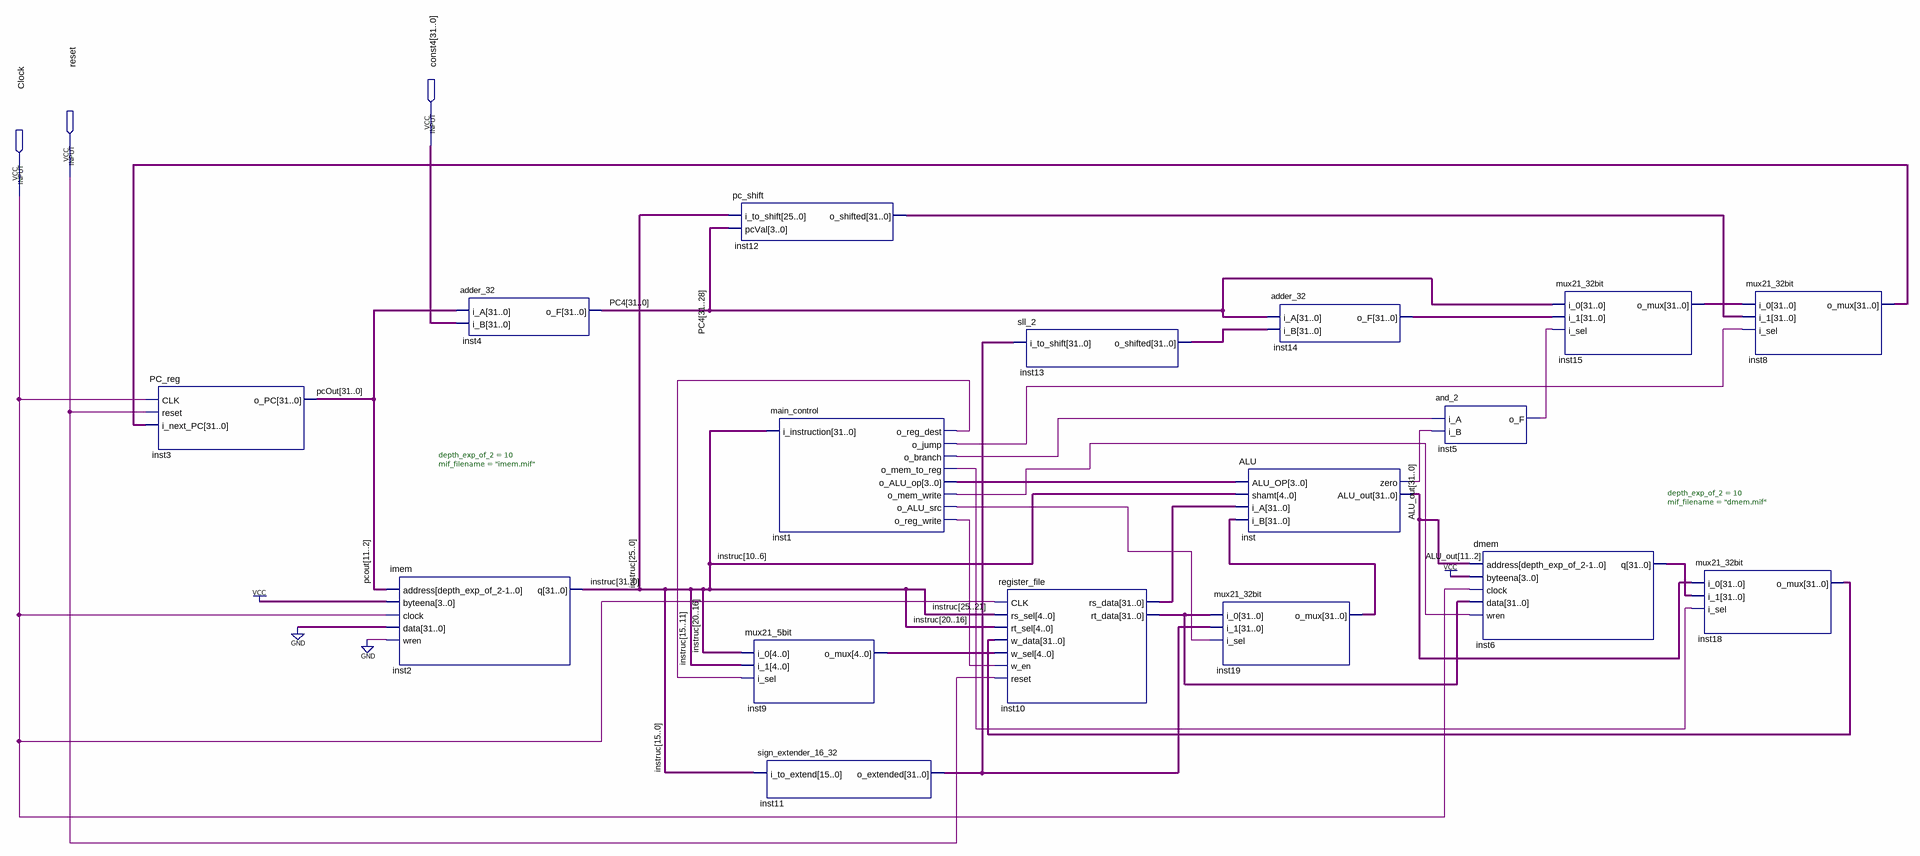
[diagram p0: schematic sheet]
// Quartus schematic Single_Cycle_MIPS_Processor.bdf as structural Verilog: 17 symbols, 3 pins
module Single_Cycle_MIPS_Processor (
  input  [31:0] const4,
  input  reset,
  input  Clock
);

  wire inst1_o_alu_src, inst1_o_branch, inst1_o_jump, inst1_o_mem_to_reg, inst1_o_mem_write,
       inst1_o_reg_dest, inst1_o_reg_write, inst5_o_f, inst_zero;
  wire [3:0] inst1_o_alu_op;
  wire [4:0] inst9_o_mux;
  wire [31:0] ALU_out, inst6_q, inst8_o_mux, inst10_rs_data, inst10_rt_data, inst11_o_extended,
       inst12_o_shifted, inst13_o_shifted, inst14_o_f, inst15_o_mux, inst18_o_mux, inst19_o_mux, instruc,
       PC4, pcOut;

  PC_reg inst3 (.CLK(Clock), .reset(reset), .i_next_PC(inst8_o_mux), .o_PC(pcOut));
  imem #(.depth_exp_of_2(10), .mif_filename("imem.mif")) inst2 (
    .address(pcOut[11:2]), .byteena(4'b1111), .clock(Clock), .data({32{1'b0}}), .wren(1'b0), .q(instruc));
  adder_32 inst4 (.i_A(pcOut), .i_B(const4), .o_F(PC4));
  pc_shift inst12 (.i_to_shift(instruc[25:0]), .pcVal(PC4[31:28]), .o_shifted(inst12_o_shifted));
  main_control inst1 (
    .i_instruction(instruc), .o_reg_dest(inst1_o_reg_dest), .o_jump(inst1_o_jump), .o_branch(inst1_o_branch),
    .o_mem_to_reg(inst1_o_mem_to_reg), .o_ALU_op(inst1_o_alu_op), .o_mem_write(inst1_o_mem_write),
    .o_ALU_src(inst1_o_alu_src), .o_reg_write(inst1_o_reg_write));
  mux21_5bit inst9 (.i_0(instruc[20:16]), .i_1(instruc[15:11]), .i_sel(inst1_o_reg_dest), .o_mux(inst9_o_mux));
  sign_extender_16_32 inst11 (.i_to_extend(instruc[15:0]), .o_extended(inst11_o_extended));
  sll_2 inst13 (.i_to_shift(inst11_o_extended), .o_shifted(inst13_o_shifted));
  register_file inst10 (
    .CLK(Clock), .rs_sel(instruc[25:21]), .rt_sel(instruc[20:16]), .w_data(inst18_o_mux),
    .w_sel(inst9_o_mux), .w_en(inst1_o_reg_write), .reset(reset), .rs_data(inst10_rs_data),
    .rt_data(inst10_rt_data));
  ALU inst (
    .ALU_OP(inst1_o_alu_op), .shamt(instruc[10:6]), .i_A(inst10_rs_data), .i_B(inst19_o_mux),
    .zero(inst_zero), .ALU_out(ALU_out));
  mux21_32bit inst19 (.i_0(inst10_rt_data), .i_1(inst11_o_extended), .i_sel(inst1_o_alu_src), .o_mux(inst19_o_mux));
  adder_32 inst14 (.i_A(PC4), .i_B(inst13_o_shifted), .o_F(inst14_o_f));
  and_2 inst5 (.i_A(inst1_o_branch), .i_B(inst_zero), .o_F(inst5_o_f));
  dmem #(.depth_exp_of_2(10), .mif_filename("dmem.mif")) inst6 (
    .address(ALU_out[11:2]), .byteena(4'b1111), .clock(Clock), .data(inst10_rt_data),
    .wren(inst1_o_mem_write), .q(inst6_q));
  mux21_32bit inst15 (.i_0(PC4), .i_1(inst14_o_f), .i_sel(inst5_o_f), .o_mux(inst15_o_mux));
  mux21_32bit inst18 (.i_0(ALU_out), .i_1(inst6_q), .i_sel(inst1_o_mem_to_reg), .o_mux(inst18_o_mux));
  mux21_32bit inst8 (.i_0(inst15_o_mux), .i_1(inst12_o_shifted), .i_sel(inst1_o_jump), .o_mux(inst8_o_mux));
endmodule
